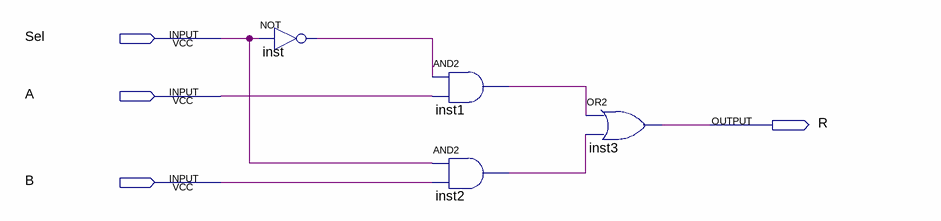
[diagram p0: schematic sheet]
// Quartus schematic sel2to1_1bit.bdf as structural Verilog: 4 symbols, 4 pins
module sel2to1_1bit (
  input  Sel,
  input  A,
  input  B,
  output R
);

  wire inst1_out, inst2_out, inst_out;

  not inst (inst_out, Sel);
  and inst1 (inst1_out, inst_out, A);
  and inst2 (inst2_out, Sel, B);
  or inst3 (R, inst1_out, inst2_out);
endmodule
